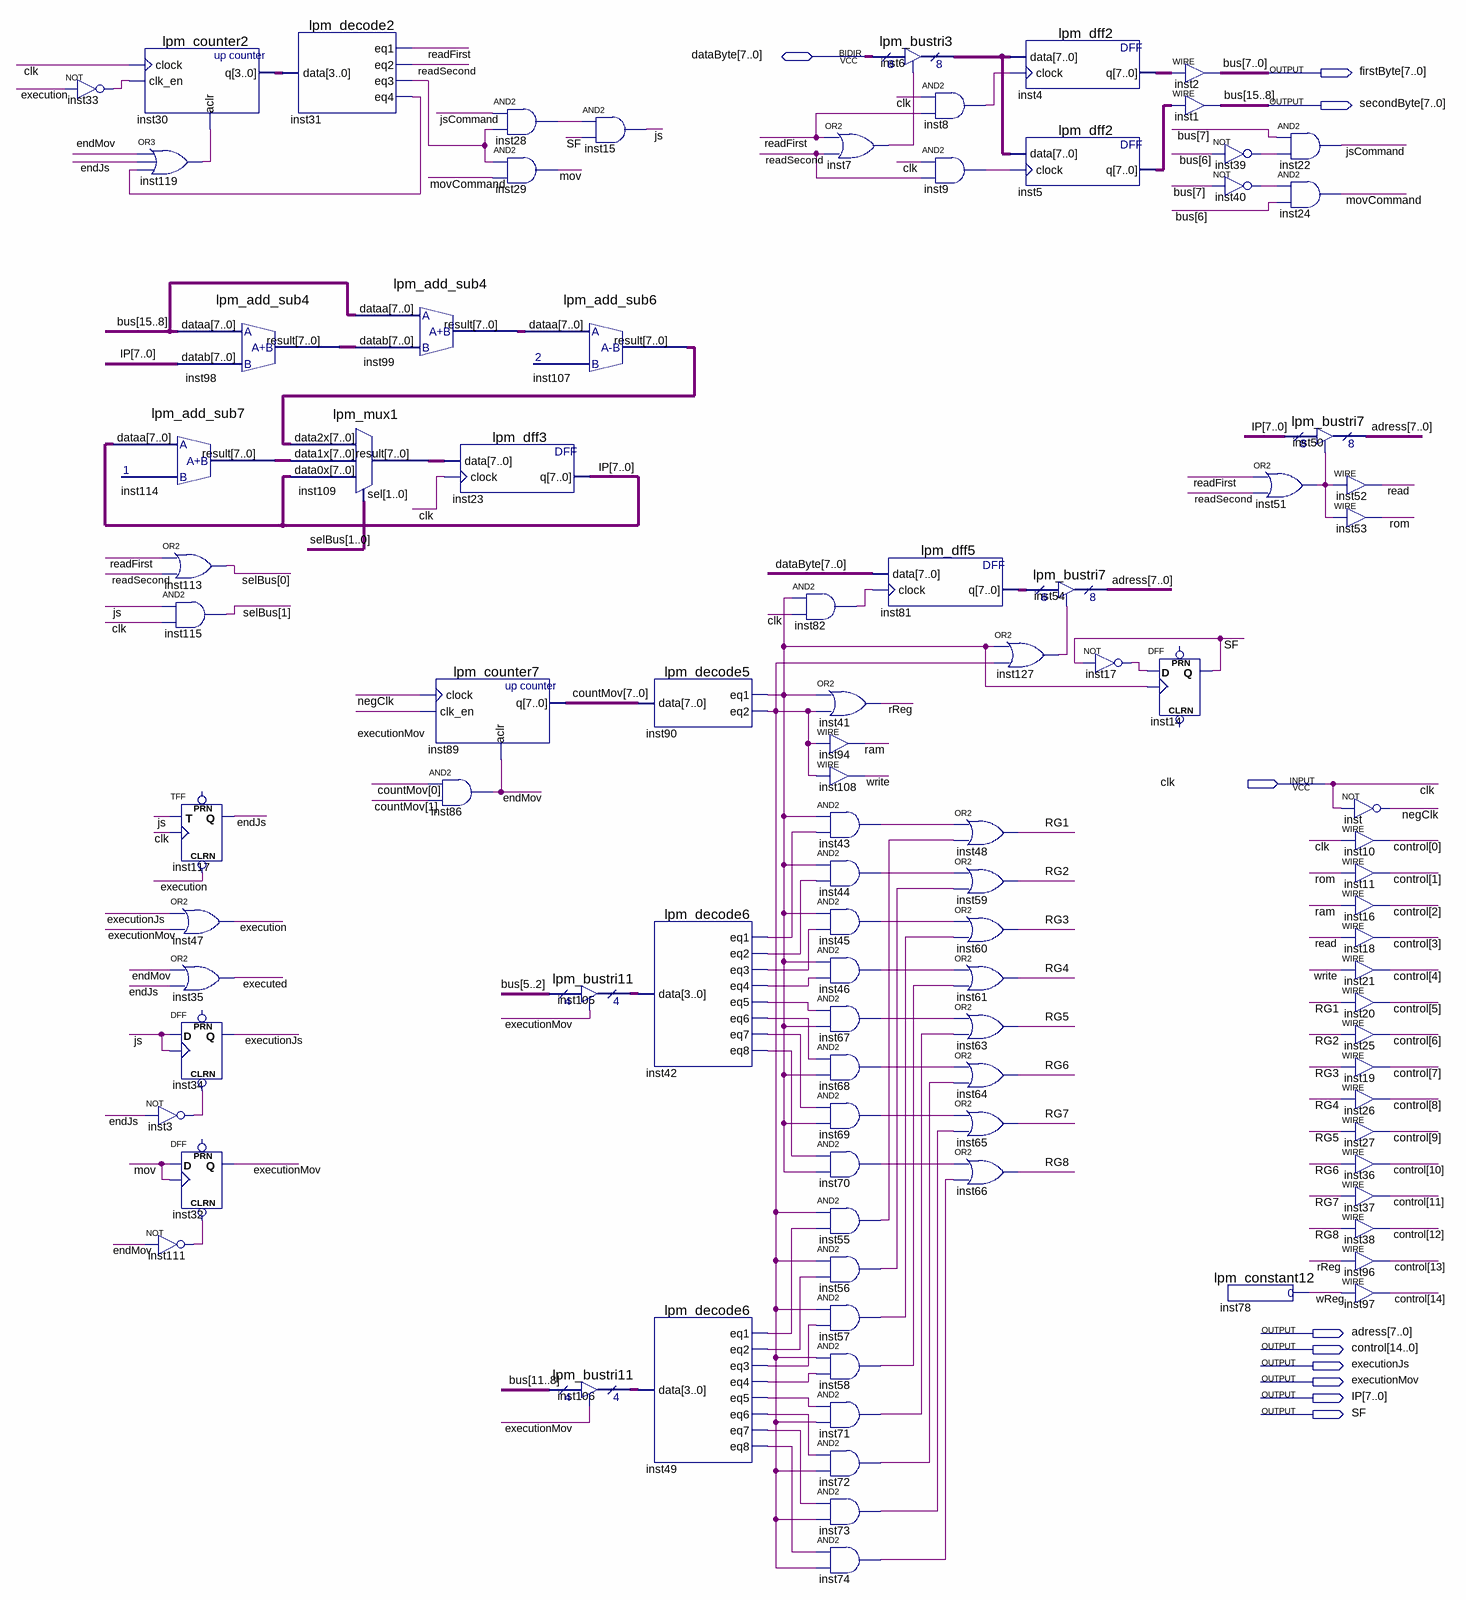
[diagram p0: schematic sheet]
// Quartus schematic Control.bdf as structural Verilog: 95 symbols, 10 pins
module Control (
  input  clk,
  inout  [7:0] dataByte,
  output [7:0] firstByte,
  output [7:0] secondByte,
  output [7:0] adress,
  output [14:0] control,
  output executionJs,
  output executionMov,
  output [7:0] IP,
  output SF
);

  wire endJs, endMov, executed, execution, inst3_out, inst7_out, inst8_out, inst9_out, inst17_out,
       inst28_out, inst31_eq3, inst31_eq4, inst33_out, inst39_out, inst40_out, inst42_eq1, inst42_eq2,
       inst42_eq3, inst42_eq4, inst42_eq5, inst42_eq6, inst42_eq7, inst42_eq8, inst43_out, inst44_out,
       inst45_out, inst46_out, inst49_eq1, inst49_eq2, inst49_eq3, inst49_eq4, inst49_eq5, inst49_eq6,
       inst49_eq7, inst49_eq8, inst51_out, inst55_out, inst56_out, inst57_out, inst58_out, inst67_out,
       inst68_out, inst69_out, inst70_out, inst71_out, inst72_out, inst73_out, inst74_out, inst82_out,
       inst90_eq1, inst90_eq2, inst111_out, inst119_out, inst127_out, js, jsCommand, mov, movCommand, negClk,
       ram, read, readFirst, readSecond, RG1, RG2, RG3, RG4, RG5, RG6, RG7, RG8, rom, rReg, wReg, write;
  wire [1:0] selBus;
  wire [3:0] inst30_q, inst105_tridata, inst106_tridata;
  wire [7:0] countMov, inst4_q, inst5_q, inst6_tridata, inst81_q, inst98_result, inst99_result,
       inst107_result, inst109_result, inst114_result;

  not inst33 (inst33_out, execution);
  lpm_counter2 inst30 (.clock(clk), .clk_en(inst33_out), .aclr(inst119_out), .q(inst30_q));
  or inst119 (inst119_out, endMov, endJs, inst31_eq4);
  lpm_add_sub7 inst114 (.dataa(IP), .result(inst114_result));
  not inst3 (inst3_out, endJs);
  not inst111 (inst111_out, endMov);
  lpm_add_sub4 inst98 (.dataa(secondByte), .datab(IP), .result(inst98_result));
  or inst113 (selBus[0], readFirst, readSecond);
  and inst115 (selBus[1], js, clk);
  TFF inst117 (.CLRN(execution), .T(js), .CLK(clk), .Q(endJs));  // open: PRN
  or inst47 (execution, executionJs, executionMov);
  or inst35 (executed, endMov, endJs);
  DFF inst34 (.CLRN(inst3_out), .CLK(js), .D(js), .Q(executionJs));  // open: PRN
  DFF inst32 (.CLRN(inst111_out), .CLK(mov), .D(mov), .Q(executionMov));  // open: PRN
  lpm_decode2 inst31 (.data(inst30_q), .eq1(readFirst), .eq2(readSecond), .eq3(inst31_eq3), .eq4(inst31_eq4));
  lpm_mux1 inst109 (
    .data2x(inst107_result), .data1x(inst114_result), .data0x(IP), .sel(selBus), .result(inst109_result));
  lpm_add_sub4 inst99 (.dataa(secondByte), .datab(inst98_result), .result(inst99_result));
  lpm_dff3 inst23 (.data(inst109_result), .clock(clk), .q(IP));
  lpm_counter7 inst89 (.clock(negClk), .clk_en(executionMov), .aclr(endMov), .q(countMov));
  and inst86 (endMov, countMov[0], countMov[1]);
  and inst28 (inst28_out, jsCommand, inst31_eq3);
  and inst29 (mov, inst31_eq3, movCommand);
  lpm_add_sub6 inst107 (.dataa(inst99_result), .result(inst107_result));
  and inst15 (js, inst28_out, SF);
  lpm_bustri11 inst105 (.enabledt(executionMov), .data(firstByte[5:2]), .tridata(inst105_tridata));
  lpm_bustri11 inst106 (.enabledt(executionMov), .data(secondByte[3:0]), .tridata(inst106_tridata));
  lpm_decode5 inst90 (.data(countMov), .eq1(inst90_eq1), .eq2(inst90_eq2));
  lpm_decode6 inst42 (
    .data(inst105_tridata), .eq1(inst42_eq1), .eq2(inst42_eq2), .eq3(inst42_eq3), .eq4(inst42_eq4),
    .eq5(inst42_eq5), .eq6(inst42_eq6), .eq7(inst42_eq7), .eq8(inst42_eq8));
  lpm_decode6 inst49 (
    .data(inst106_tridata), .eq1(inst49_eq1), .eq2(inst49_eq2), .eq3(inst49_eq3), .eq4(inst49_eq4),
    .eq5(inst49_eq5), .eq6(inst49_eq6), .eq7(inst49_eq7), .eq8(inst49_eq8));
  and inst82 (inst82_out, inst90_eq1, clk);
  or inst7 (inst7_out, readFirst, readSecond);
  or inst41 (rReg, inst90_eq1, inst90_eq2);
  assign ram = inst90_eq2;  // WIRE inst94
  assign write = inst90_eq2;  // WIRE inst108
  and inst43 (inst43_out, inst90_eq1, inst42_eq1);
  and inst44 (inst44_out, inst90_eq1, inst42_eq2);
  and inst45 (inst45_out, inst90_eq1, inst42_eq3);
  and inst46 (inst46_out, inst90_eq1, inst42_eq4);
  and inst67 (inst67_out, inst42_eq5, inst90_eq1);
  and inst68 (inst68_out, inst42_eq6, inst90_eq1);
  and inst69 (inst69_out, inst42_eq7, inst90_eq1);
  and inst70 (inst70_out, inst42_eq8, inst90_eq1);
  and inst55 (inst55_out, inst90_eq2, inst49_eq1);
  and inst56 (inst56_out, inst90_eq2, inst49_eq2);
  and inst57 (inst57_out, inst90_eq2, inst49_eq3);
  and inst58 (inst58_out, inst90_eq2, inst49_eq4);
  and inst71 (inst71_out, inst49_eq5, inst90_eq2);
  and inst72 (inst72_out, inst49_eq6, inst90_eq2);
  and inst73 (inst73_out, inst49_eq7, inst90_eq2);
  and inst74 (inst74_out, inst49_eq8, inst90_eq2);
  lpm_bustri3 inst6 (.enabledt(inst7_out), .data(dataByte), .tridata(inst6_tridata));
  and inst8 (inst8_out, clk, readFirst);
  and inst9 (inst9_out, clk, readSecond);
  lpm_dff5 inst81 (.data(dataByte), .clock(inst82_out), .q(inst81_q));
  or inst48 (RG1, inst43_out, inst55_out);
  or inst59 (RG2, inst44_out, inst56_out);
  or inst60 (RG3, inst45_out, inst57_out);
  or inst61 (RG4, inst46_out, inst58_out);
  or inst63 (RG5, inst67_out, inst71_out);
  or inst64 (RG6, inst68_out, inst72_out);
  or inst65 (RG7, inst69_out, inst73_out);
  or inst66 (RG8, inst70_out, inst74_out);
  lpm_dff2 inst4 (.data(inst6_tridata), .clock(inst8_out), .q(inst4_q));
  lpm_dff2 inst5 (.data(inst6_tridata), .clock(inst9_out), .q(inst5_q));
  lpm_bustri7 inst54 (.enabledt(inst127_out), .data(inst81_q), .tridata(adress));
  or inst127 (inst127_out, inst90_eq1, inst90_eq2);
  not inst17 (inst17_out, SF);
  assign firstByte = inst4_q;  // WIRE inst2
  assign secondByte = inst5_q;  // WIRE inst1
  DFF inst14 (.CLK(inst90_eq1), .D(inst17_out), .Q(SF));  // open: CLRN, PRN
  not inst39 (inst39_out, firstByte[6]);
  not inst40 (inst40_out, firstByte[7]);
  lpm_constant12 inst78 (.result(wReg));
  and inst22 (jsCommand, firstByte[7], inst39_out);
  and inst24 (movCommand, inst40_out, firstByte[6]);
  lpm_bustri7 inst50 (.enabledt(inst51_out), .data(IP), .tridata(adress));
  or inst51 (inst51_out, readFirst, readSecond);
  assign read = inst51_out;  // WIRE inst52
  assign rom = inst51_out;  // WIRE inst53
  not inst (negClk, clk);
  assign control[0] = clk;  // WIRE inst10
  assign control[1] = rom;  // WIRE inst11
  assign control[2] = ram;  // WIRE inst16
  assign control[3] = read;  // WIRE inst18
  assign control[4] = write;  // WIRE inst21
  assign control[5] = RG1;  // WIRE inst20
  assign control[6] = RG2;  // WIRE inst25
  assign control[7] = RG3;  // WIRE inst19
  assign control[8] = RG4;  // WIRE inst26
  assign control[9] = RG5;  // WIRE inst27
  assign control[10] = RG6;  // WIRE inst36
  assign control[11] = RG7;  // WIRE inst37
  assign control[12] = RG8;  // WIRE inst38
  assign control[13] = rReg;  // WIRE inst96
  assign control[14] = wReg;  // WIRE inst97

  // Other names for the same wires on the sheet: bus[15:0] = {secondByte, firstByte}
endmodule
